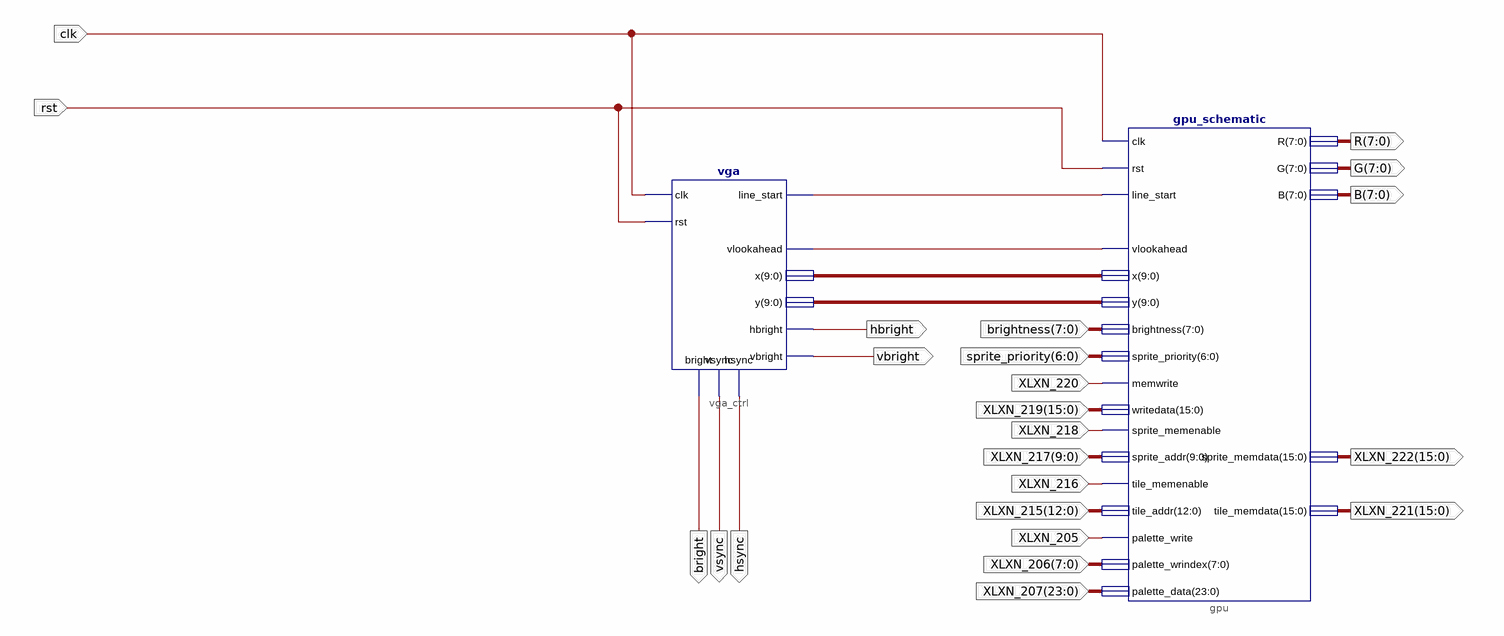
[diagram p0: schematic sheet 1]
// Xilinx ISE schematic system.sch (spartan3e) as structural Verilog: 2 symbols, 23 ports
module system (
  input  rst,
  input  XLXN_205,
  input  [7:0] XLXN_206,
  input  [23:0] XLXN_207,
  input  clk,
  input  [7:0] brightness,
  input  [6:0] sprite_priority,
  input  [12:0] XLXN_215,
  input  XLXN_216,
  input  [9:0] XLXN_217,
  input  XLXN_218,
  input  [15:0] XLXN_219,
  input  XLXN_220,
  output [7:0] B,
  output [7:0] G,
  output [7:0] R,
  output bright,
  output vsync,
  output hsync,
  output vbright,
  output hbright,
  output [15:0] XLXN_221,
  output [15:0] XLXN_222
);

  wire XLXN_26, XLXN_28;
  wire [9:0] XLXN_15, XLXN_17;

  gpu_schematic gpu (
    .clk(clk), .x(XLXN_15), .y(XLXN_17), .line_start(XLXN_26), .brightness(brightness),
    .sprite_priority(sprite_priority), .palette_write(XLXN_205), .palette_wrindex(XLXN_206),
    .palette_data(XLXN_207), .tile_addr(XLXN_215), .tile_memenable(XLXN_216), .tile_memdata(XLXN_221),
    .sprite_memdata(XLXN_222), .sprite_addr(XLXN_217), .sprite_memenable(XLXN_218), .writedata(XLXN_219),
    .memwrite(XLXN_220), .rst(rst), .B(B), .G(G), .R(R), .vlookahead(XLXN_28));
  vga vga_ctrl (
    .clk(clk), .rst(rst), .bright(bright), .vsync(vsync), .hsync(hsync), .vlookahead(XLXN_28),
    .line_start(XLXN_26), .x(XLXN_15), .y(XLXN_17), .vbright(vbright), .hbright(hbright));
endmodule
